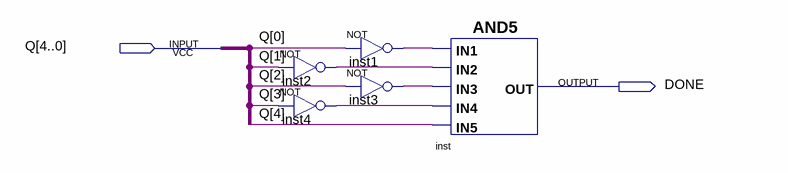
[diagram p0: schematic sheet]
// Quartus schematic DCfC.bdf as structural Verilog: 5 symbols, 2 pins
module DCfC (
  input  [4:0] Q,
  output DONE
);

  wire inst1_out, inst2_out, inst3_out, inst4_out;

  not inst2 (inst2_out, Q[1]);
  not inst4 (inst4_out, Q[3]);
  not inst1 (inst1_out, Q[0]);
  not inst3 (inst3_out, Q[2]);
  and inst (DONE, inst1_out, inst2_out, inst3_out, inst4_out, Q[4]);
endmodule
